# EAGLE design wifi_board (EAGLE 9.6.1)
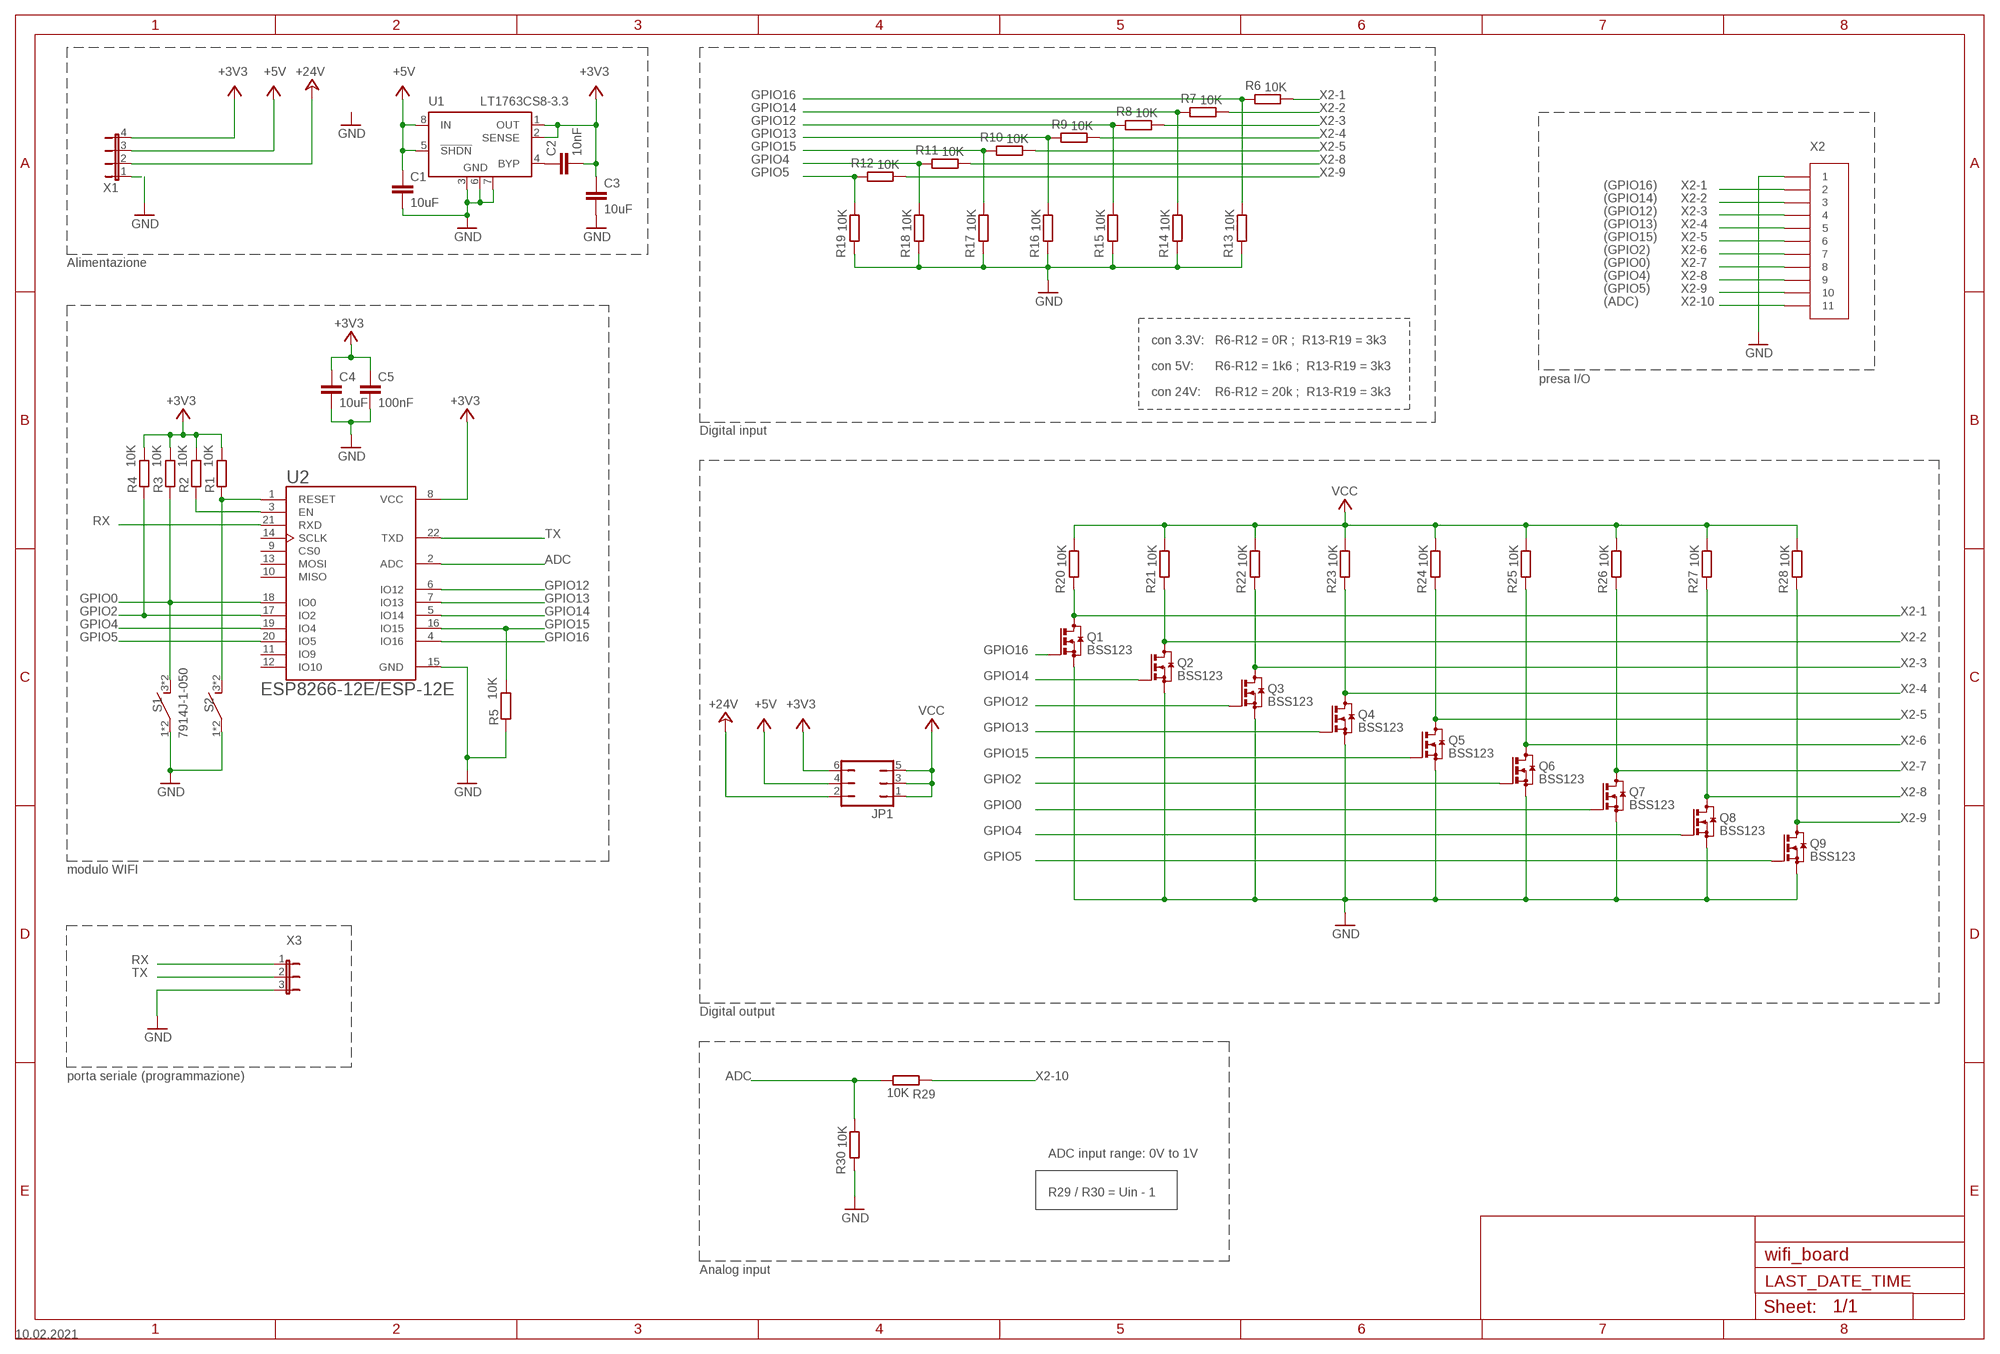
[diagram p0: schematic, sheet 1]
FRAME1 (A3L-LOC): DATE: 10.02.2021

## Parts
C1  10uF  C-EUC0805  [C0805]
C2  10nF  C-EUC0805  [C0805]
C3  10uF  C-EUC0805  [C0805]
C4  10uF  C-EUC0805  [C0805]
C5  100nF  C-EUC0805  [C0805]
JP1  JP3Q  [JP3Q]
Q1  BSS123  [SOT23]
Q2  BSS123  [SOT23]
Q3  BSS123  [SOT23]
Q4  BSS123  [SOT23]
Q5  BSS123  [SOT23]
Q6  BSS123  [SOT23]
Q7  BSS123  [SOT23]
Q8  BSS123  [SOT23]
Q9  BSS123  [SOT23]
R1  10K  R-EU_R0805  [R0805]
R2  10K  R-EU_R0805  [R0805]
R3  10K  R-EU_R0805  [R0805]
R4  10K  R-EU_R0805  [R0805]
R5  10K  R-EU_R0805  [R0805]
R6  10K  R-EU_R0805  [R0805]
R7  10K  R-EU_R0805  [R0805]
R8  10K  R-EU_R0805  [R0805]
R9  10K  R-EU_R0805  [R0805]
R10  10K  R-EU_R0805  [R0805]
R11  10K  R-EU_R0805  [R0805]
R12  10K  R-EU_R0805  [R0805]
R13  10K  R-EU_R0805  [R0805]
R14  10K  R-EU_R0805  [R0805]
R15  10K  R-EU_R0805  [R0805]
R16  10K  R-EU_R0805  [R0805]
R17  10K  R-EU_R0805  [R0805]
R18  10K  R-EU_R0805  [R0805]
R19  10K  R-EU_R0805  [R0805]
R20  10K  R-EU_R0805  [R0805]
R21  10K  R-EU_R0805  [R0805]
R22  10K  R-EU_R0805  [R0805]
R23  10K  R-EU_R0805  [R0805]
R24  10K  R-EU_R0805  [R0805]
R25  10K  R-EU_R0805  [R0805]
R26  10K  R-EU_R0805  [R0805]
R27  10K  R-EU_R0805  [R0805]
R28  10K  R-EU_R0805  [R0805]
R29  10K  R-EU_R0805  [R0805]
R30  10K  R-EU_R0805  [R0805]
S1  7914J-1-050  [7914J1000E]
S2  7914J-1-050  [7914J1000E]
U1  LT1763CS8-3.3  [SOIC8]
U2  ESP8266-12E/ESP-12E  [XCVR_ESP8266-12E/ESP-12E]
X1  JP4E  [JP4]
X2  X11P  [X11P]
X3  JP2E  [JP2]

## Nets
+3V3 [power]: C2.2 C3.1 C4.1 C5.1 JP1.6 R1.2 R2.2 R3.2 R4.2 U1.1(OUT) U1.2(SENSE) U2.8(VCC) X1.4
+5V [power]: C1.1 JP1.4 U1.5(!SHDN) U1.8(IN) X1.3
+24V [power]: JP1.2 X1.2
ADC: R29.1 R30.1 U2.2(ADC)
GND [power]: C1.2 C3.2 C4.2 C5.2 Q1.2(S) Q2.2(S) Q3.2(S) Q4.2(S) Q5.2(S) Q6.2(S) Q7.2(S) Q8.2(S) Q9.2(S) R5.1 R13.2 R14.2 R15.2 R16.2 R17.2 R18.2 R19.2 R30.2 S1.1 S1.2 S2.1 S2.2 U1.3(GND) U1.6(GND) U1.7(GND) U2.15(GND) X1.1 X2.1 X3.3
GPIO0: Q7.1(G) R3.1 S1.3 S1.4 U2.18(IO0)
GPIO2: Q6.1(G) R4.1 U2.17(IO2)
GPIO4: Q8.1(G) R11.2 R18.1 U2.19(IO4)
GPIO5: Q9.1(G) R12.2 R19.1 U2.20(IO5)
GPIO12: Q3.1(G) R8.2 R15.1 U2.6(IO12)
GPIO13: Q4.1(G) R9.2 R16.1 U2.7(IO13)
GPIO14: Q2.1(G) R7.2 R14.1 U2.5(IO14)
GPIO15: Q5.1(G) R5.2 R10.2 R17.1 U2.16(IO15)
GPIO16: Q1.1(G) R6.2 R13.1 U2.4(IO16)
N$1: R1.1 S2.3 S2.4 U2.1(RESET)
N$3: R2.1 U2.3(EN)
N$5: C2.1 U1.4(BYP)
RX: U2.21(RXD) X3.1
TX: U2.22(TXD) X3.2
VCC [power]: JP1.1 JP1.3 JP1.5 R20.1 R21.1 R22.1 R23.1 R24.1 R25.1 R26.1 R27.1 R28.1
X2-1: Q1.3(D) R6.1 R20.2 X2.2
X2-2: Q2.3(D) R7.1 R21.2 X2.3
X2-3: Q3.3(D) R8.1 R22.2 X2.4
X2-4: Q4.3(D) R9.1 R23.2 X2.5
X2-5: Q5.3(D) R10.1 R24.2 X2.6
X2-6: Q6.3(D) R25.2 X2.7
X2-7: Q7.3(D) R26.2 X2.8
X2-8: Q8.3(D) R11.1 R27.2 X2.9
X2-9: Q9.3(D) R12.1 R28.2 X2.10
X2-10: R29.2 X2.11
Unconnected: U2.9(CS0) U2.10(MISO) U2.11(IO9) U2.12(IO10) U2.13(MOSI) U2.14(SCLK)

## Notes on the sheet
- (GPIO16)
- (GPIO14)
- (GPIO12)
- (GPIO13)
- (GPIO15)
- (GPIO2)
- Alimentazione | (GPIO0)
- (GPIO4)
- (GPIO5)
- (ADC)
- con 3.3V:   R6-R12 = 0R ;  R13-R19 = 3k3
- con 5V:      R6-R12 = 1k6 ;  R13-R19 = 3k3
- presa I/O
- con 24V:    R6-R12 = 20k ;  R13-R19 = 3k3
- Digital input
- modulo WIFI
- Digital output
- porta seriale (programmazione)
- ADC input range: 0V to 1V
- R29 / R30 = Uin - 1
- Analog input

## Library data of the parts
C1-C5 = rcl:C-EU: CAPACITOR, European symbol; SPICEPREFIX: C
JP1 = jumper:JP3Q: JUMPER
Q1-Q9 = transistor-small-signal:BSS123: N-CHANNEL MOS FET
R1-R30 = rcl:R-EU_: RESISTOR, European symbol; SPICEPREFIX: R
S1 S2 = 7914J-1-050:7914J-1-050: Tactile Switches 4mm KEY SWITCH SMD J-Hook Source: Datasheet <https://componentsearchengine.com/Datasheets/1/7914J-1-050.pdf> Check prices <https://pricing.snapeda.com/parts/7914J-1-050/Bourns/view-part?ref=eda>; AVAILABILITY: Warning; DESCRIPTION: Tactile Switch SPST-NO Top Actuated Surface Mount; MF: Bourns; MP: 7914J-1-050; PACKAGE: None; PRICE: None; PURCHASE-URL: https://pricing.snapeda.com/search/part/7914J-1-050/?ref=eda
U1 = linear-technology:LT1763CS8: 500mA, Low Noise, LDO Micropower Regulators Source: http://cds.linear.com/docs/Datasheet/1763ff.pdf; MPN: LT1763CS8-3.3; OC_FARNELL: 1273617; OC_NEWARK: 57M6055
U2 = ESP8266-12E_ESP-12E:ESP8266-12E/ESP-12E: ESP-12E WiFi Module; AVAILABILITY: Unavailable; DESCRIPTION: This WiFi module has a 32-bit MCU micro and clock speeds supporting 80 MHz or 160 MHz. Supports the RTOS and integrated Wi-Fi MAC/BB/RF/PA/LNA, and has an on-board antenna.; MF: AI-Thinker; MP: ESP8266-12E/ESP-12E; PACKAGE: None; PRICE: None
X1 = jumper:JP4E: JUMPER
X2 = Domenico:X11P: presa stift 11 poli
X3 = jumper:JP2E: JUMPER

## Net classes
0 default: width 0.6 mm
2 power: width 0.8 mm

## Board
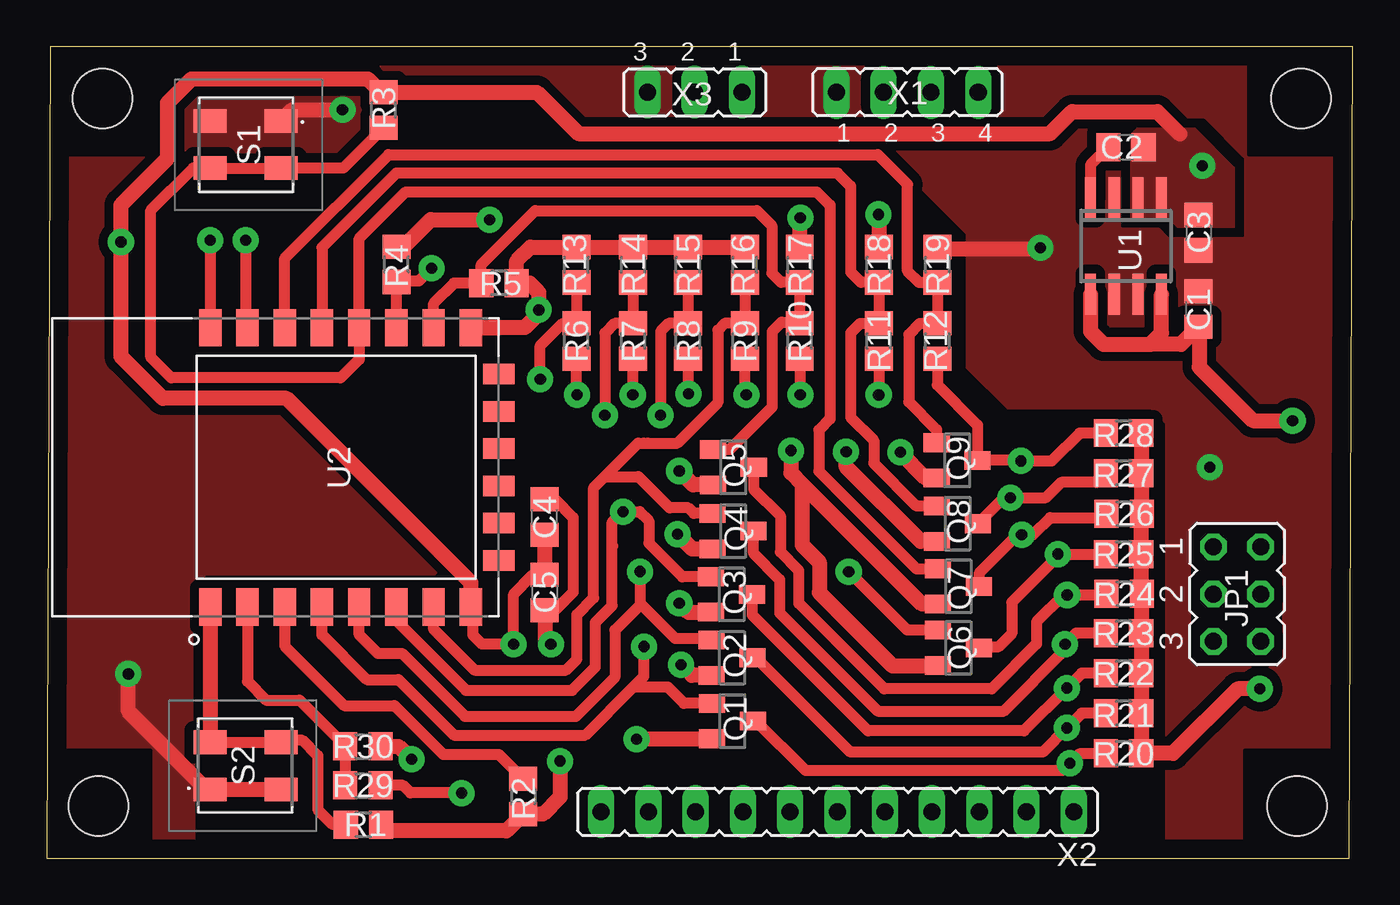
[diagram p1: board, top side]
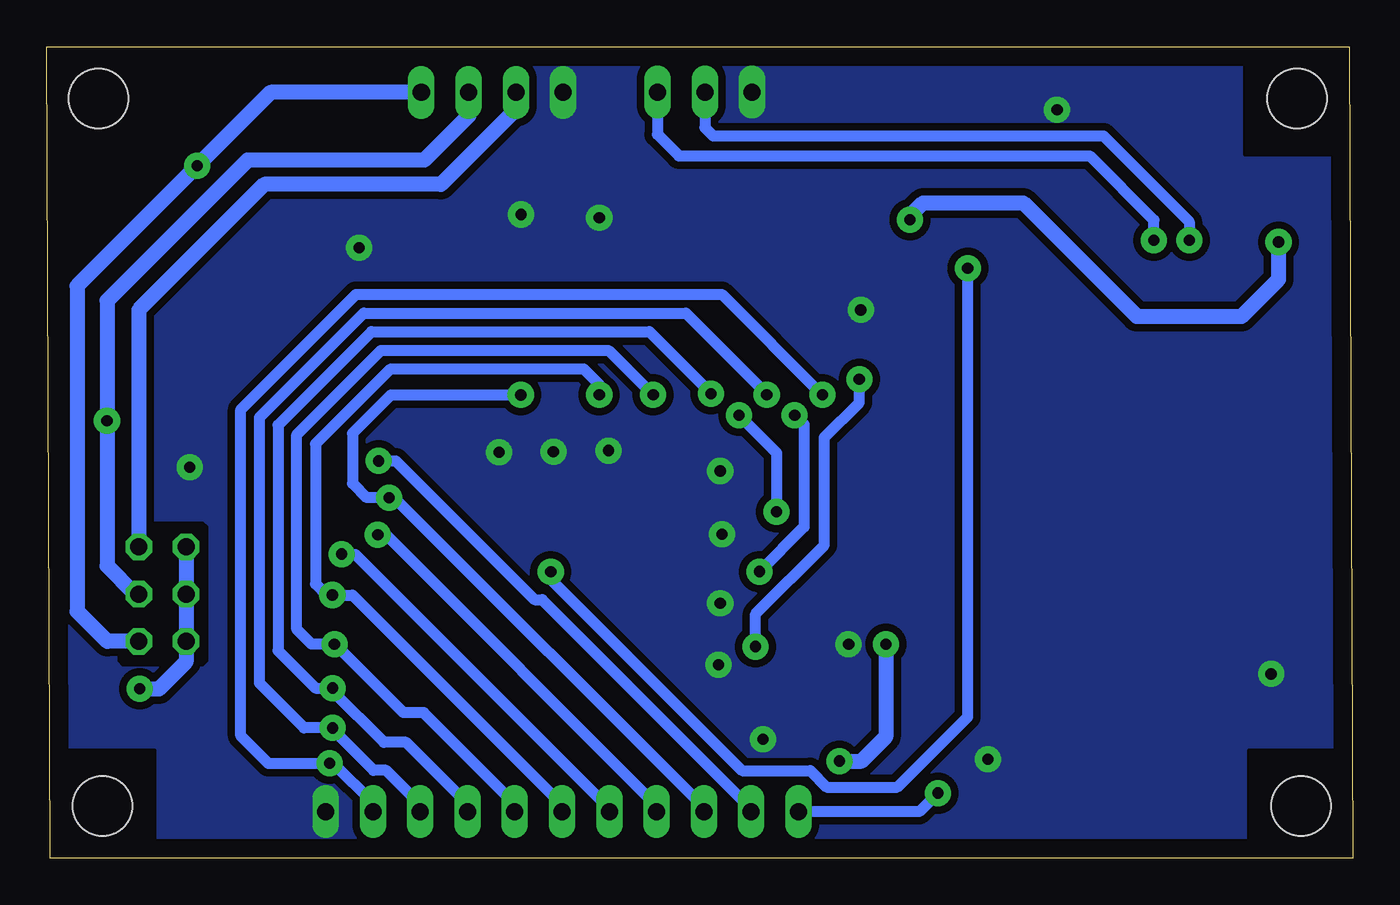
[diagram p2: board, bottom side, seen from below]

Size 70.2 x 43.6 mm. Coordinates in mm from the lower left corner, seen from the top.
Outline: 0,0 70,0 70.2,43.6 0.2,43.6 0,0
Copper layers (1*16): Top 0.035mm / dielectric 1.5mm / Bottom 0.035mm
Design rules "default *": minimum track width 6mil, minimum drill 0.35mm, track to track 0.4mm, track to pad 0.4mm, pad to pad 0.4mm, via to via 0.4mm, smd to smd 6mil, copper to edge 40mil, drill to drill 6mil, minimum pad ring 10mil, minimum via ring 0.4mm, stop-mask expansion 4mil, vias tented up to drill 0mil, thermal gap 10mil
Holes 3.2 mm at 3,40.8 67.4,40.8 2.8,2.8 67.2,2.8

### Footprints (pad centres in the part's own frame; a part is rotated, then mirrored left to right if it is on the bottom)
C0805 = smd 1.3 x 1.5: 1 -0.95,0; 2 0.95,0
JP3Q = drill 0.914 octagon: 1 -2.54,-1.27; 2 -2.54,1.27; 3 0,-1.27; 4 0,1.27; 5 2.54,-1.27; 6 2.54,1.27
SOT23 = smd 1 x 1.4: 1 -0.95,-1.1; 2 0.95,-1.1; 3 0,1.1
R0805 = smd 1.3 x 1.5: 1 -0.95,0; 2 0.95,0
7914J1000E = smd 1.27 x 1.78: 1 -1.29,1.605; 2 -1.29,-2.205; 3 1.25,1.605; 4 1.25,-2.205
SOIC8 = smd 0.6 x 2.2: 1 -1.905,-2.6; 2 -0.635,-2.6; 3 0.635,-2.6; 4 1.905,-2.6; 5 1.905,2.6; 6 0.635,2.6; 7 -0.635,2.6; 8 -1.905,2.6
XCVR_ESP8266-12E/ESP-12E = smd 2 x 1.2: 1 -7.5,7; 2 -7.5,5; 3 -7.5,3; 4 -7.5,1; 5 -7.5,-1; 6 -7.5,-3; 7 -7.5,-5; 8 -7.5,-7; 15 7.5,-7; 16 7.5,-5; 17 7.5,-3; 18 7.5,-1; 19 7.5,1; 20 7.5,3; 21 7.5,5; 22 7.5,7 | smd 1.1 x 1.7: 9 -5,-8.5; 10 -3,-8.5; 11 -1,-8.5; 12 1,-8.5; 13 3,-8.5; 14 5,-8.5
JP4 = drill 0.914 long: 1 -3.81,0; 2 -1.27,0; 3 1.27,0; 4 3.81,0
X11P = drill 0.914 long: 1 0,0; 2 2.54,0; 3 5.08,0; 4 7.62,0; 5 10.16,0; 6 12.7,0; 7 15.24,0; 8 17.78,0; 9 20.32,0; 10 22.86,0; 11 25.4,0
JP2 = drill 0.914 long: 1 -2.54,0; 2 0,0; 3 2.54,0

### Placement (x,y rotation side)
C1  61.9,29.5 90 top
C2  58,38.2 0 top
C3  61.9,33.6 270 top
C4  26.76,18.33 90 top
C5  26.76,14.27 270 top
JP1  63.97,14.19 270 top
Q1  36.85,7.37 270 top
Q2  36.83,10.77 270 top
Q3  36.81,14.17 270 top
Q4  36.89,17.57 270 top
Q5  36.9,21 270 top
Q6  49,11.3 270 top
Q7  49,14.6 270 top
Q8  48.95,17.97 270 top
Q9  48.93,21.37 270 top
R1  17.03,1.81 0 top
R2  25.61,3.32 270 top
R3  18.11,40.19 90 top
R4  18.8,31.9 90 top
R5  24.31,30.89 180 top
R6  28.47,27.78 90 top
R7  31.52,27.78 90 top
R8  34.47,27.78 90 top
R9  37.52,27.78 90 top
R10  40.47,27.78 90 top
R11  44.72,27.78 90 top
R12  47.87,27.78 90 top
R13  28.47,31.88 90 top
R14  31.52,31.88 90 top
R15  34.47,31.88 90 top
R16  37.52,31.88 90 top
R17  40.47,31.88 90 top
R18  44.72,31.88 90 top
R19  47.87,31.88 90 top
R20  57.87,5.63 180 top
R21  57.87,7.79 180 top
R22  57.87,9.94 180 top
R23  57.87,12.09 180 top
R24  57.9,14.2 180 top
R25  57.87,16.34 180 top
R26  57.9,18.5 180 top
R27  57.87,20.69 180 top
R28  57.87,22.84 180 top
R29  17,3.91 0 top
R30  17,6.01 0 top
S1  11,38.32 270 top
S2  10.4,4.98 90 top
U1  58,32.89 180 top
U2  15.8,21 90 top
X1  46.25,41.14 0 top
X2  55.2,2.5 180 top
X3  34.83,41.15 180 top

### Tracks (layer width: path | path; a pad name or v marks a point on that pad's centre or on a via)
+3V3  (via drill 0.6)
  Top 0.6: 22.9,13.4 22.9,12 23.4,11.5 v25.1,11.5 25.1,14.19 26.13,15.22 C5.1
  Top 0.8: 22.7,13.5 U2.8 | U2.8 22.8,14.8 12.9,24.7 6.24,24.7 4,26.94 v4,33.1 4,35.1 6.5,37.6 6.5,40.57 7.77,41.84 17.28,41.84 17.98,41.14 R3.2 26.35,41.14 28.57,38.92 53.92,38.92 55.1,40.1 59.7,40.1 60.9,38.9 | v27.6,5.22 27.6,3.3 26.67,2.37 R2.2 24.71,1.47 18.34,1.47 18.33,1.46 R1.2 | U2.8 22.9,13.4 | C4.1 C5.1 | R4.2 19.2,32.85 20.65,34.3 v23.8,34.3
  Bottom 0.8: X1.4 58.16,41.14 v62.1,37.2 68.55,30.75 68.55,13.26 66.94,11.65 JP1.6 | v27.6,5.22 26.4,5.22 25.1,6.52 v25.1,11.5 | v23.8,34.3 23.8,34.5 23.1,35.2 17.72,35.2 11.62,29.1 5.98,29.1 4,31.08 v4,33.1
  pour Top (isolate 0.5, no thermals): 58.3,34.4 58.3,38.9 58.6,39.2 61.7,39.2 63.8,37.1 63.8,33.9 60.8,33.9 60.3,34.4
+5V  (via drill 0.6)
  Top 0.8: v66.95,23.5 64.82,23.5 61.94,26.38 61.94,28.51 C1.1 60.95,27.6 59.3,27.6 | U1.5 56.09,28.3 56.8,27.6 59.3,27.6 | U1.8 59.91,28.2 59.3,27.6
  Bottom 0.8: JP1.4 65.44,14.19 66.95,15.7 v66.95,23.5 66.95,29.95 59.4,37.5 49.9,37.5 47.52,39.88 X1.3
+24V
  Bottom 0.8: X1.2 44.98,40.22 49,36.2 58.5,36.2 65.24,29.46 JP1.2
ADC
  Top 0.6: 11,13.3 U2.2 10.8,9.5 11.8,8.5 13.6,8.5 16.05,6.05 R30.1 R29.1
GND  (via drill 0.6)
  Top 0.6: C4.2 27.32,19.28 28.3,18.3 28.3,14.3 27.32,13.32 C5.2
  Top 0.8: Q4.2 35.77,16.6 34.7,16.6 v33.9,17.4 | Q3.2 35.69,13.2 34.5,13.2 v34,13.7 | Q2.2 34.68,9.82 v34.1,10.4 | Q1.2 35.73,6.4 v31.7,6.4 | S1.1 13.2,40.2 v15.9,40.2 | R30.2 18.91,6.01 v19.61,5.31 | Q9.2 47.24,20.42 45.88,21.78 v45.88,21.8 | Q8.2 46.97,17.02 42.97,21.03 v42.97,21.83 | v40,21.9 40,20.7 40.6,20.1 | S2.2 S2.1 | S2.1 8.51,3.69 8.3,3.9 8.59,3.9 S2.1 | S2.1 8.61,3.69 4.4,7.9 v4.4,9.9 | R16.2 R15.2 R14.2 R13.2 26,32.83 25.26,32.09 R5.1 25.96,30.89 26.45,30.4 v26.45,29.45 26.45,29.25 25.7,28.5 U2.15 24.2,28.5 | v53.4,32.8 53.3,32.7 48,32.7 R19.2 | v44.7,34.58 44.72,34.56 R18.2 | v40.5,34.4 40.47,34.4 R17.2 | C5.2 26.8,13.28 26.8,11.8 v27.1,11.5 | v34,20.8 34.75,20.05 Q5.2 | Q6.2 47.87,10.32 45.48,10.32 41.53,14.27 41.53,15.91 40.6,16.84 40.6,20.1 | Q7.2 47.05,13.65 40.6,20.1
  other vias: 62.5,21
  pour Top (isolate 0.5, rank 2, no thermals): 0.2,43.6 70,43.6 70,0 0.2,0
  pour Bottom (isolate 0.4, no thermals): 0.2,43.6 70,43.6 70,0 0.2,0
  cutout Top: 8.1,0 8.1,14.6 8.6,15.1 20.9,15.1 22.1,16.3 22.1,35.2 23,36.1 46.7,36.1 49.3,33.5 49.3,26.3 51.6,24 59.3,24 60,23.3 60,0
  cutout Top: 0.2,43.6 5.8,43.6 5.8,37.8 0.2,37.8
  cutout Bottom: 0.2,43.6 5.8,43.6 5.8,37.8 0.2,37.8
  cutout Top: 61.8,18 66.1,18 66.3,17.8 66.3,10.6 66.1,10.4 61.8,10.4 61.6,10.6 61.6,17.8
  cutout Bottom: 61.8,18 66.1,18 66.3,17.8 66.3,10.6 66.1,10.4 61.8,10.4 61.6,10.6 61.6,17.8
GND1
  cutout Top: 64.6,43.6 70.2,43.6 70.2,37.8 64.6,37.8
GND2
  cutout Top: 64.4,5.8 70,5.8 70,0 64.4,0
GND3
  cutout Top: 0,5.8 5.6,5.8 5.6,0 0,0
GND4
  cutout Bottom: 0,5.8 5.6,5.8 5.6,0 0,0
GND5
  cutout Bottom: 64.4,5.8 70,5.8 70,0 64.4,0
GND6
  cutout Bottom: 64.6,43.6 70.2,43.6 70.2,37.8 64.6,37.8
GPIO0
  Top 0.6: R3.1 15.94,37.07 S1.3 S1.4 7.87,37.07 5.6,34.8 5.6,26.9 6.7,25.8 15.8,25.8 16.8,26.8 U2.18 16.8,33.3 19.3,35.8 41.38,35.8 42.1,35.08 42.1,23.6 41.5,23 41.5,20.8 46.75,15.55 Q7.1
GPIO2  (via drill 0.6)
  Top 0.6: Q6.1 46.25,12.25 v43.1,15.39 | U2.17 R4.1 18.85,31 20,31 v20.7,31.7
  Bottom 0.6: v43.1,15.39 43.1,14.98 32.82,4.7 29.16,4.7 28.28,3.82 24.48,3.82 20.7,7.6 v20.7,31.7
GPIO4
  Top 0.6: Q8.1 46.75,18.92 44.45,21.22 44.45,22.45 43.2,23.7 43.2,28.2 43.73,28.73 R11.2 R18.1 43.77,30.93 43.2,31.5 43.2,36.1 42.5,36.8 18.79,36.8 14.8,32.81 U2.19
GPIO5
  Top 0.6: Q9.1 47.83,23.02 46.33,24.52 46.33,28.13 46.93,28.73 R12.2 R19.1 46.88,30.93 46.27,31.54 46.27,36.2 44.67,37.8 18.37,37.8 12.8,32.23 U2.20
GPIO12  (via drill 0.6)
  Top 0.6: R15.1 R8.2 33.43,28.73 33,28.3 v33,23.8 | Q3.1 34.17,15.12 32.37,16.92 32.37,18.12 31.87,18.62 v30.97,18.62 30.4,18.05 30.4,16.75 | 30.42,16.77 30.4,16.75 | U2.6 18.8,12.75 22.53,9.02 28.24,9.02 29.5,10.28 29.5,12.67 30.39,13.57 30.39,16.75 30.4,16.75
  Bottom 0.6: v33,23.8 30.97,21.77 v30.97,18.62
GPIO13
  Top 0.6: R16.1 R9.2 36.43,28.73 36.07,28.37 36.07,24.47 33.9,22.3 32.3,22.3 32.1,22.3 31.79,22.3 29.99,20.5 | U2.7 20.8,12.3 23,10.1 27.91,10.1 28.5,10.69 28.5,13.09 29.39,13.98 29.39,19.91 29.99,20.5 | Q4.1 34.79,18.52 34.49,18.82 33.48,18.82 31.8,20.5 29.99,20.5
GPIO14  (via drill 0.6)
  Top 0.6: R14.1 R7.2 30.53,28.73 30,28.2 v30,23.8 | Q2.1 35.65,11.8 33.8,11.8 31.89,13.7 v31.89,15.4 31.89,13.6 30.55,12.25 30.55,9.72 28.45,7.62 22.48,7.62 19.1,11 17.8,11 16.8,12 U2.5
  Bottom 0.6: v31.89,15.4 29.5,17.8 29.5,23.3 v30,23.8
GPIO15
  Top 0.6: U2.16 20.8,29.8 21.89,30.89 R5.2 23.36,31.88 26.26,34.78 38.17,34.78 38.97,33.98 38.97,31.43 39.47,30.93 R17.1 40.47,28.8 | 40.47,28.8 R10.2 | Q5.1 36.7,21.95 39,24.25 39,28.3 39.5,28.8 40.47,28.8
GPIO16  (via drill 0.6)
  Top 0.6: U2.4 15,13.3 15,12.9 14.8,12.7 14.8,12 17.2,9.6 18.91,9.6 21.89,6.62 28.95,6.62 31.52,9.19 | R13.1 R6.2 27.73,28.73 26.53,27.53 v26.53,25.73 | Q1.1 34.25,8.32 33.38,9.19 31.52,9.19 | 31.52,9.19 32.1,9.77 v32.1,11.37
  Bottom 0.6: 32.13,11.37 v32.1,11.37 32.1,13.12 28.4,16.82 28.4,22.6 26.53,24.47 v26.53,25.73
N$1
  Top 0.6: S2.3 S2.4 | 12.71,6.13 S2.4 | R1.1 15.38,1.81 14.58,2.61 14.58,5.51 13.76,6.33 12.61,6.33 S2.4
  Top 0.8: U2.1 S2.3
N$3
  Top 0.6: U2.3 12.8,11.4 16,8.2 18.7,8.2 21.33,5.57 24.31,5.57 R2.1
N$5
  Top 0.6: C2.1 56.09,37.24 U1.4
RX  (via drill 0.6)
  Top 0.6: v10.7,33.2 10.7,28.6 U2.21
  Bottom 0.6: X3.1 37.37,38.88 36.22,37.73 14.15,37.73 10.7,34.28 v10.7,33.2
TX  (via drill 0.6)
  Top 0.6: v8.8,33.2 U2.22
  Bottom 0.6: X3.2 34.83,39.25 34.38,38.8 13.4,38.8 8.8,34.2 v8.8,33.2
VCC  (via drill 0.6)
  Top 0.8: R28.1 R27.1 58.85,20.66 R26.1 58.82,18.47 R25.1 58.82,14.23 | 58.82,14.23 R23.1 | R23.1 R22.1 R21.1 R20.1 60.53,5.63 64,9.1 v65.2,9.1 | R23.1 | R24.1 58.82,14.23
  Bottom 0.8: JP1.1 JP1.3 | JP1.3 JP1.5 62.7,10.55 64.15,9.1 v65.2,9.1 | 62.59,14.3 JP1.3
X2-1  (via drill 0.6)
  Top 0.6: R20.2 56.92,5.6 55.49,5.6 v54.99,5.1 54.59,4.7 40.8,4.7 38.13,7.37 Q1.3 | v28.5,24.9 28.47,24.93 R6.1
  Bottom 0.6: v28.5,24.9 28.52,24.9 33.91,30.29 53.57,30.29 59.76,24.09 59.76,6.57 58.29,5.1 v54.99,5.1 54.79,5.1 52.66,2.97 X2.2
X2-2  (via drill 0.6)
  Top 0.6: R21.2 55.62,7.79 v54.83,7 53.53,5.7 43.2,5.7 38.13,10.77 Q2.3 | R7.1 31.5,26.81 v31.5,24.9
  Bottom 0.6: v31.5,24.9 31.5,24.93 35.85,29.29 53.15,29.29 58.76,23.68 58.76,9.4 56.36,7 v54.83,7 54.83,6.92 52.63,4.72 51.95,4.72 50.12,2.89 X2.3
X2-3  (via drill 0.6)
  Top 0.6: R22.2 55.62,9.94 v54.82,9.14 52.52,6.84 44.14,6.84 37.91,13.07 Q3.3 | v34.5,24.95 34.5,26.8 R8.1
  Bottom 0.6: v34.5,24.95 34.5,24.98 37.8,28.29 52.74,28.29 57.76,23.26 57.76,11.15 55.75,9.14 v54.82,9.14 54.82,8.97 52.07,6.22 50.88,6.22 47.58,2.93 X2.4
X2-4  (via drill 0.6)
  Top 0.6: R23.2 55.32,12.09 v54.73,11.5 54.73,11.2 51.43,7.9 44.67,7.9 39.39,13.18 39.39,14.97 37.99,16.37 Q4.3 | v37.6,24.9 37.52,24.98 R9.1
  Bottom 0.6: v37.6,24.9 37.62,24.9 40.01,27.29 52.22,27.29 56.76,22.75 56.76,12.3 55.96,11.5 v54.73,11.5 54.7,11.5 51.02,7.82 49.94,7.82 45.04,2.93 X2.5
X2-5  (via drill 0.6)
  Top 0.6: v54.84,14.14 54.77,14.07 | v40.5,24.9 40.5,26.8 R10.1 | R24.2 56.89,14.14 v54.84,14.14 | v54.84,14.14 54.64,14.14 53.2,12.7 53.2,11.51 50.79,9.1 45.01,9.1 40.43,13.68 40.43,15.45 39.43,16.45 39.43,18.4 38,19.83 Q5.3
  Bottom 0.6: v40.5,24.9 40.5,25.45 41.34,26.29 51.71,26.29 55.74,22.25 55.74,14.74 55.14,14.14 v54.84,14.14 53.76,14.14 42.5,2.88 X2.6
X2-6  (via drill 0.6)
  Top 0.6: R25.2 v54.34,16.34 54.34,16.22 51.87,13.75 51.87,12.07 51.17,11.37 50.17,11.37 Q6.3
  Bottom 0.6: v54.34,16.34 54.32,16.32 53.61,16.32 39.96,2.67 X2.7
X2-7  (via drill 0.6)
  Top 0.6: R26.2 56.75,18.3 53.93,18.3 53,17.37 v52.4,17.37 52.17,17.37 50.1,15.3 Q7.3 50.24,14.6
  Bottom 0.6: 52.48,17.37 v52.4,17.37 51.96,17.37 37.42,2.83 X2.8
X2-8  (via drill 0.6)
  Top 0.6: R27.2 56.42,20.19 54.52,20.19 53.7,19.37 v51.8,19.37 51.45,19.37 Q8.3 | R11.1 v44.72,24.89
  Bottom 0.6: v51.8,19.37 51.7,19.27 | v51.8,19.37 53,19.37 53.76,20.13 53.76,22.82 51.7,24.89 v44.72,24.89 | v51.8,19.37 51.52,19.37 34.88,2.73 X2.9
X2-9  (via drill 0.6)
  Top 0.6: R28.2 55.52,22.84 54.02,21.34 v52.36,21.34 52.33,21.37 Q9.3 | Q9.3 49.87,21.53 | R12.1 47.87,25.43 50.03,23.27 Q9.3
  Bottom 0.6: v52.36,21.34 51.43,21.34 43.98,13.89 43.57,13.89 32.34,2.67 X2.10 32.34,2.73
X2-10  (via drill 0.6)
  Top 0.6: v22.3,3.5 v22.29,3.51 19.55,3.51 19.15,3.91 R29.2
  Bottom 0.6: v22.3,3.5 23.3,2.5 X2.11